# Altium schematic sheet Sheet1.SchDoc
size A4
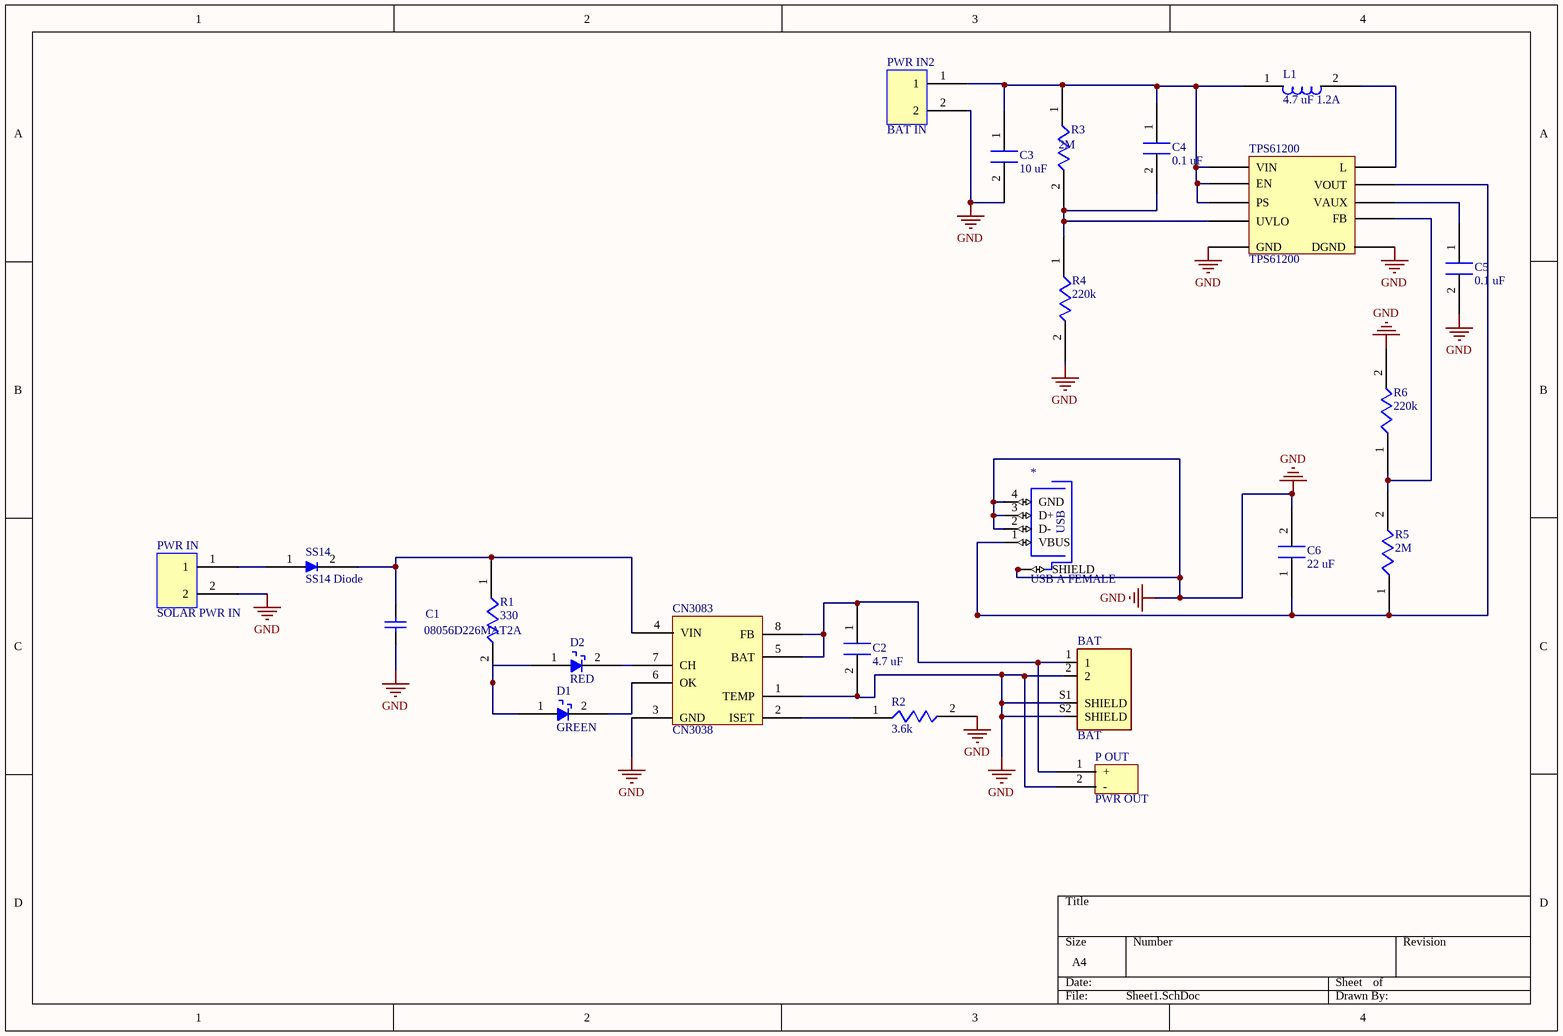
[diagram p0: Sheet1.SchDoc]

## Parts
*  USB A FEMALE  [USB A female]
BAT  BAT  [BAT]
C1  08056D226MAT2A  [CAPC2013X140X50LL20T25]
C2  4.7 uF  [CAPACITOR 0402]
C3  10 uF  [CAPACITOR 0805]
C4  0.1 uF  [CAPACITOR 0402]
C5  0.1 uF  [CAPACITOR 0402]
C6  22 uF  [CAPACITOR 0805]
CN3083  CN3038  [CN3083]
D1  GREEN  [DIODE 0603]
D2  RED  [DIODE 0603]
L1  4.7 uF 1.2A  [LPS3015]
P_OUT  PWR OUT  [PWR]
PWR_IN  SOLAR PWR IN  [PWR]
PWR_IN2  BAT IN  [PWR]
R1  330  [RESISTOR 0402]
R2  3.6k  [RESISTOR 0402]
R3  2M  [RESISTOR 0805]
R4  220k  [RESISTOR 0805]
R5  2M  [RESISTOR 0805]
R6  220k  [RESISTOR 0402]
SS14  SS14 Diode  [SS14]
TPS61200  TPS61200  [TPS61200]

## Nets
GND: *.2(D-) *.3(D+) *.4(GND) *.SHELL(SHIELD) *.SHELL1(SHIELD) BAT.2 BAT.S1(SHIELD) BAT.S2(SHIELD) C1.2 C2.2 C3.2 C5.2 C6.2 CN3083.1(TEMP) CN3083.3(GND) P_OUT.2(-) PWR_IN.2 PWR_IN2.2 R2.2 R4.2 R6.2 TPS61200.4(DGND) TPS61200.9(GND)
Net*_1: *.1(VBUS) C6.1 R5.1 TPS61200.2(VOUT)
NetBAT_1: BAT.1 C2.1 CN3083.5(BAT) CN3083.8(FB) P_OUT.1(+)
NetC1_1: C1.1 CN3083.4(VIN) R1.1 SS14.2
NetC3_1: C3.1 C4.1 L1.1 PWR_IN2.1 R3.1 TPS61200.5(VIN) TPS61200.6(EN) TPS61200.8(PS)
NetC4_2: C4.2 R3.2 R4.1 TPS61200.7(UVLO)
NetC5_1: C5.1 TPS61200.1(VAUX)
NetCN3083_2: CN3083.2(ISET) R2.1
NetCN3083_6: CN3083.6(OK) D1.2
NetCN3083_7: CN3083.7(CH) D2.2
NetD1_1: D1.1 D2.1 R1.2
NetL1_2: L1.2 TPS61200.3(L)
NetPWR_IN_1: PWR_IN.1 SS14.1
NetR5_2: R5.2 R6.1 TPS61200.10(FB)

## Notes on the sheet
- (in symbol USB A FEMALE) USB

## Library data of the parts
C1 = CMP-001-00083-1: AVX         08056D226MAT2A.            CERAMIC CAPACITOR, 22UF, 6.3V, X5R, 20%, 0805, FULL REEL; Dissipation Factor: 12.5%; Insulation Resistance: 10GR; Capacitance: 22uF; Case/Package: 0805; Case Code (Imperial): 0805; Case Code (Metric): 2012; Depth: 1.25mm; Dielectric: X5R; Dielectric Material: Ceramic; Height: 1.4mm; Lead Free: Lead Free; Length: 2.01mm; Max Operating Temperature: 85°C; Min Operating Temperature: -55°C; Mount: Surface Mount,PCB; Number of Pins: 2; Package Quantity: 1; Packaging: Tape and Reel; Radiation Hardening: No; REACH SVHC: No SVHC; RoHS Compliant: Yes; Termination: SMD/SMT; Thickness: 0.055inch; Tolerance: 20%; Voltage: 6.3V; Voltage Rating (DC): 6.3V; Voltage Rating: 6.3V; Width: 0.049inch
C2 C4 C5 = Capacitor 0402
C3 C6 = Capacitor 0805
D1 D2 = Diode 0603
L1 = Inductor: LPS3015 - 222MRB
PWR_IN2 = SOLAR PWR IN
R1 R2 R6 = Resistor 0402
R3-R5 = Resistor 0805